# Altium schematic sheet ECAT0_(IN).SchDoc
size A3; SheetNumber: 3; SheetTotal: 7
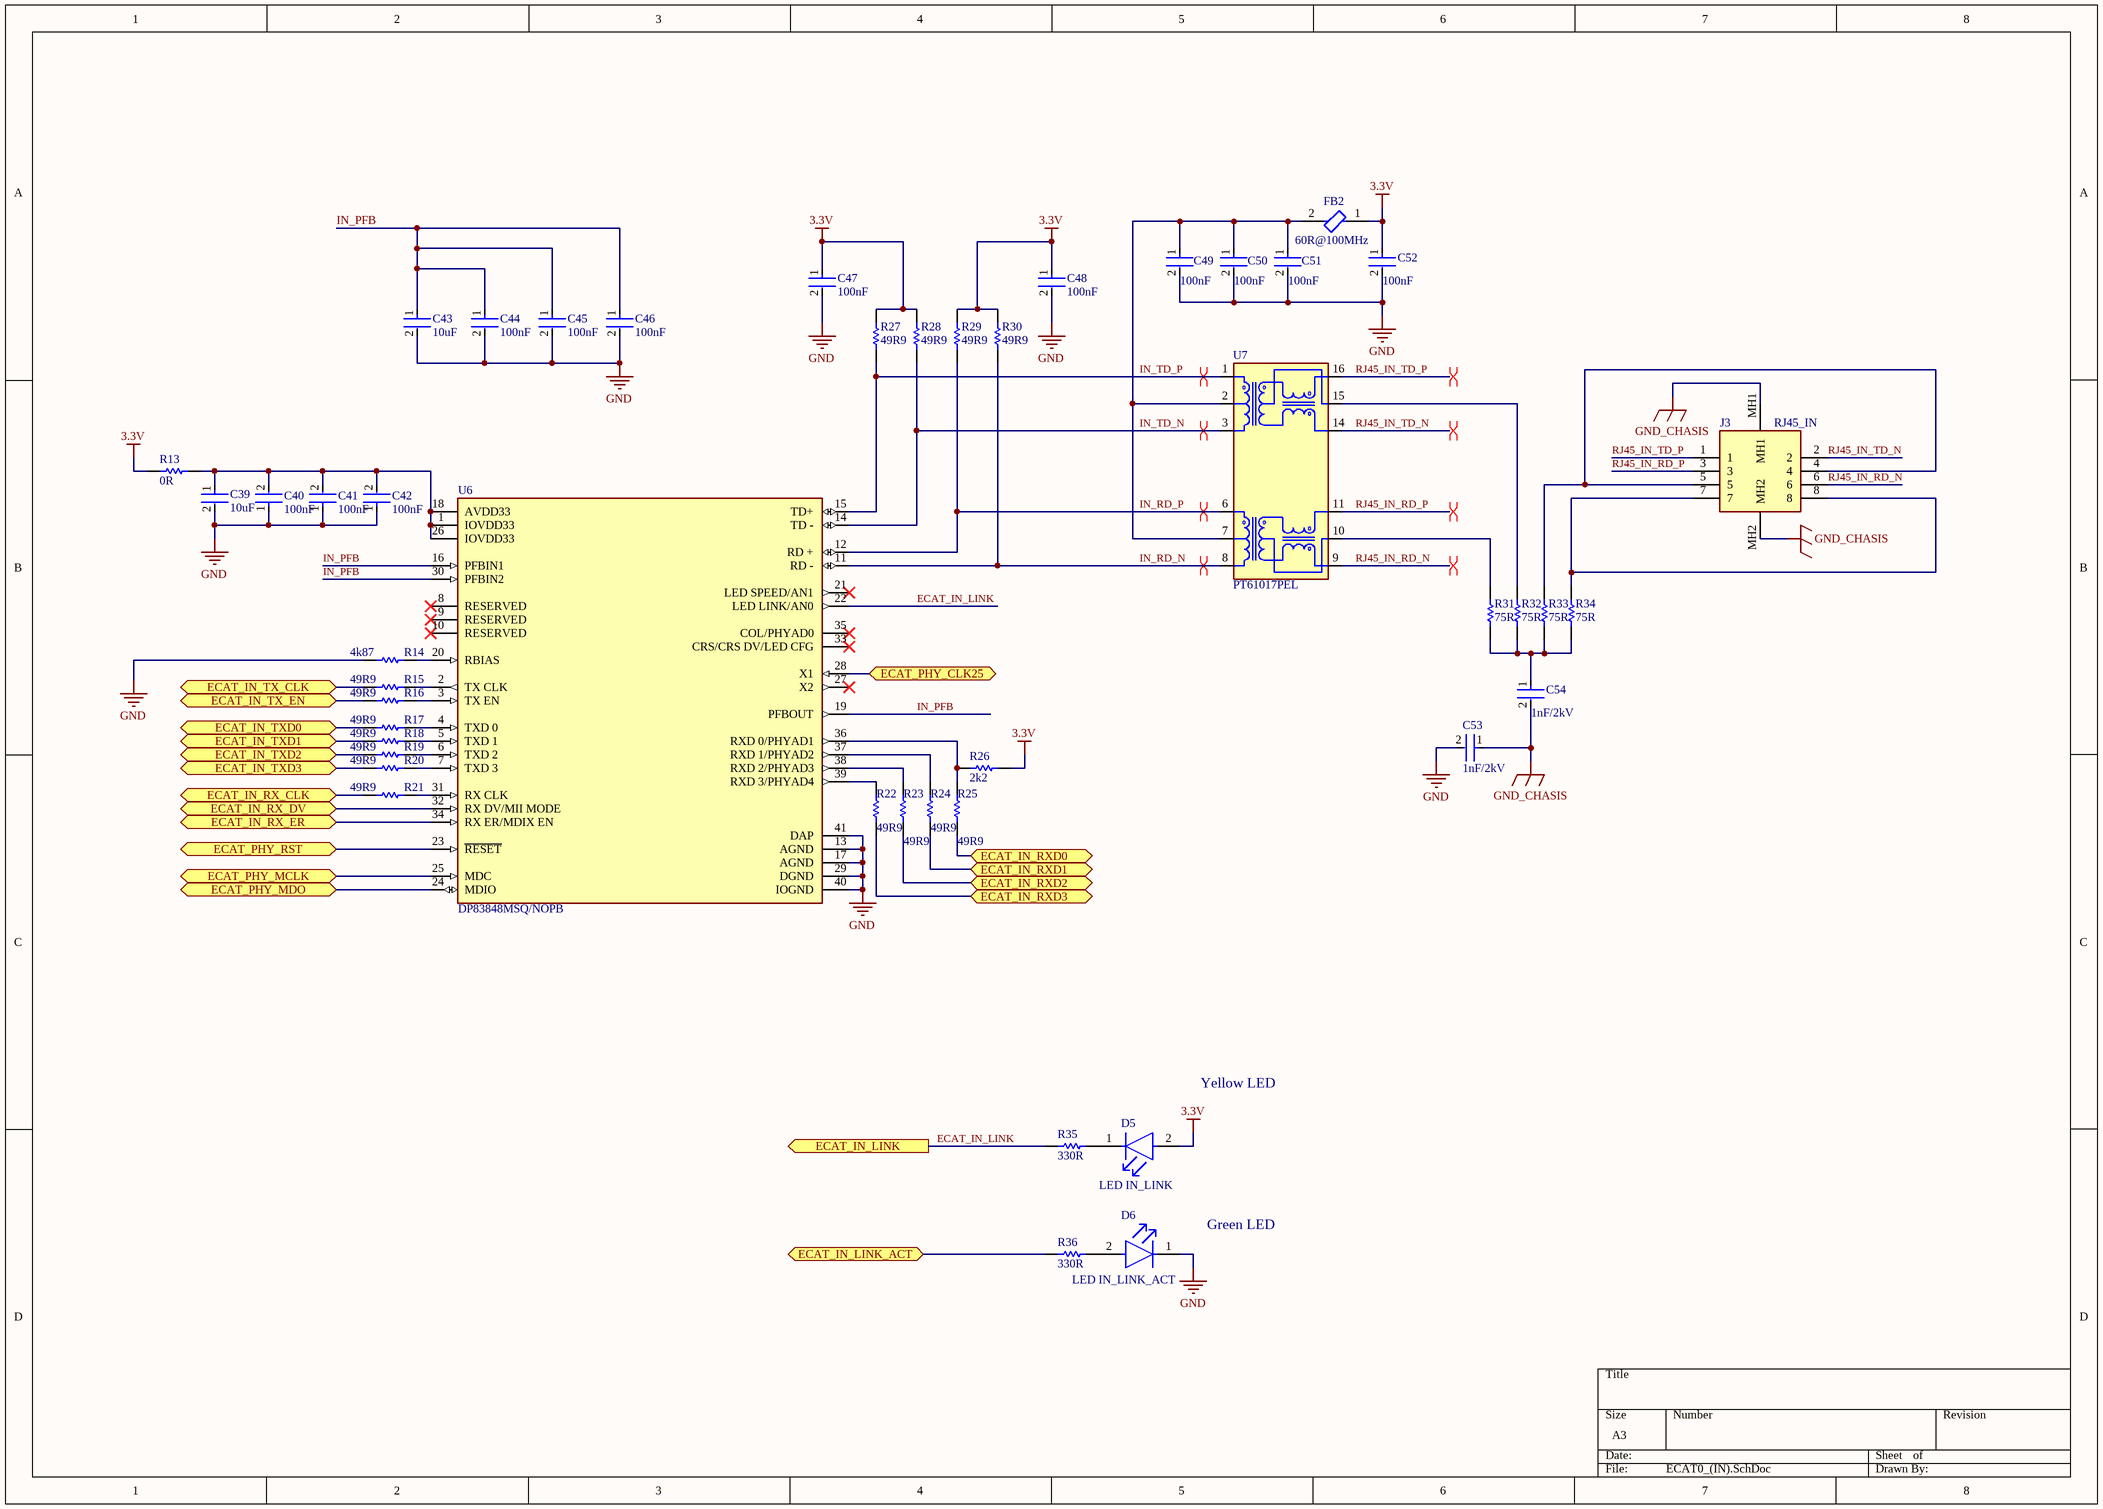
[diagram p0: ECAT0_(IN).SchDoc]

## Parts
C39  10uF  [FP-C0805C-DN-MFG]
C40  100nF  [FP-C0805C-DN-MFG]
C41  100nF  [FP-C0805C-DN-MFG]
C42  100nF  [FP-C0805C-DN-MFG]
C43  10uF  [FP-C0805C-DN-MFG]
C44  100nF  [FP-C0805C-DN-MFG]
C45  100nF  [FP-C0805C-DN-MFG]
C46  100nF  [FP-C0805C-DN-MFG]
C47  100nF  [FP-C0805C-DN-MFG]
C48  100nF  [FP-C0805C-DN-MFG]
C49  100nF  [FP-C0805C-DN-MFG]
C50  100nF  [FP-C0805C-DN-MFG]
C51  100nF  [FP-C0805C-DN-MFG]
C52  100nF  [FP-C0805C-DN-MFG]
C53  1nF/2kV  [FP-CC1206-0_3-1_45-IPC_C]
C54  1nF/2kV  [FP-CC1206-0_3-1_45-IPC_C]
D5  LED IN_LINK  [FP-LTST-C191GKT-MFG]
D6  LED IN_LINK_ACT  [FP-LTST-C191GKT-MFG]
FB2  60R@100MHz  [FP-BLM18-0_15-t0_8-IPC_B]
J3  RJ45_IN  [438600010]
R13  0R  [RESC1609X50X30NL8T20]
R14  4k87  [RESC2013X50X30LL20T20]
R15  49R9  [RESC2013X50X30LL20T20]
R16  49R9  [RESC2013X50X30LL20T20]
R17  49R9  [RESC2013X50X30LL20T20]
R18  49R9  [RESC2013X50X30LL20T20]
R19  49R9  [RESC2013X50X30LL20T20]
R20  49R9  [RESC2013X50X30LL20T20]
R21  49R9  [RESC2013X50X30LL20T20]
R22  49R9  [RESC2013X50X30LL20T20]
R23  49R9  [RESC2013X50X30LL20T20]
R24  49R9  [RESC2013X50X30LL20T20]
R25  49R9  [RESC2013X50X30LL20T20]
R26  2k2  [RESC2013X50X30LL20T20]
R27  49R9  [RESC2013X50X30LL20T20]
R28  49R9  [RESC2013X50X30LL20T20]
R29  49R9  [RESC2013X50X30LL20T20]
R30  49R9  [RESC2013X50X30LL20T20]
R31  75R  [RESC2013X50X30LL20T20]
R32  75R  [RESC2013X50X30LL20T20]
R33  75R  [RESC2013X50X30LL20T20]
R34  75R  [RESC2013X50X30LL20T20]
R35  330R  [RESC2013X50X30LL20T20]
R36  330R  [RESC2013X50X30LL20T20]
U6  DP83848MSQ/NOPB  [FP-RTA0040A-IPC_B]
U7  PT61017PEL  [PT61017PEL]

## Ports
ECAT_IN_LINK (out, see MCU[7B]), ECAT_IN_LINK_ACT (bidir, see MCU[7B]), ECAT_IN_RX_CLK (bidir, see MCU[7B]), ECAT_IN_RX_DV (bidir, see MCU[7C]), ECAT_IN_RX_ER (bidir, see MCU[5A]), ECAT_IN_RXD0 (bidir, see MCU[7A]), ECAT_IN_RXD1 (bidir, see MCU[7A]), ECAT_IN_RXD2 (bidir, see MCU[7A]), ECAT_IN_RXD3 (bidir, see MCU[7A]), ECAT_IN_TX_CLK (bidir, see MCU[7B]), ECAT_IN_TX_EN (bidir, see MCU[7B]), ECAT_IN_TXD0 (bidir, see MCU[7C]), ECAT_IN_TXD1 (bidir, see MCU[7C]), ECAT_IN_TXD2 (bidir, see MCU[7C]), ECAT_IN_TXD3 (bidir, see MCU[7B]), ECAT_PHY_CLK25 (bidir, see ECAT1_(OUT)[4B], MCU[6D]), ECAT_PHY_MCLK (bidir, see ECAT1_(OUT)[1C], MCU[5B]), ECAT_PHY_MDO (bidir, see ECAT1_(OUT)[1C], MCU[5B]), ECAT_PHY_RST (bidir, see ECAT1_(OUT)[1C], MCU[6C])

## Nets
3.3V: C47.1 C48.1 C52.1 D5.2(A) FB2.1 R13.2 R26.1 R27.2 R28.2 R29.2 R30.2
GND: C39.2 C40.1 C41.1 C42.1 C43.2 C44.2 C45.2 C46.2 C47.2 C48.2 C49.2 C50.2 C51.2 C52.2 C53.2 D6.1(C) R14.1 U6.13(AGND) U6.17(AGND) U6.29(DGND) U6.40(IOGND) U6.41(DAP)
GND_CHASIS: C53.1 C54.2 J3.MH1 J3.MH2
ECAT_IN_LINK: R35.1 U6.22(LED_LINK/AN0) ; port ECAT_IN_LINK
ECAT_IN_LINK_ACT: R36.1 ; port ECAT_IN_LINK_ACT
ECAT_IN_RX_CLK: R21.1 ; port ECAT_IN_RX_CLK
ECAT_IN_RX_DV: U6.32(RX_DV/MII_MODE) ; port ECAT_IN_RX_DV
ECAT_IN_RX_ER: U6.34(RX_ER/MDIX_EN) ; port ECAT_IN_RX_ER
ECAT_IN_RXD0: R25.1 ; port ECAT_IN_RXD0
ECAT_IN_RXD1: R24.1 ; port ECAT_IN_RXD1
ECAT_IN_RXD2: R23.1 ; port ECAT_IN_RXD2
ECAT_IN_RXD3: R22.1 ; port ECAT_IN_RXD3
ECAT_IN_TX_CLK: R15.1 ; port ECAT_IN_TX_CLK
ECAT_IN_TX_EN: R16.1 ; port ECAT_IN_TX_EN
ECAT_IN_TXD0: R17.1 ; port ECAT_IN_TXD0
ECAT_IN_TXD1: R18.1 ; port ECAT_IN_TXD1
ECAT_IN_TXD2: R19.1 ; port ECAT_IN_TXD2
ECAT_IN_TXD3: R20.1 ; port ECAT_IN_TXD3
ECAT_PHY_CLK25: U6.28(X1) ; port ECAT_PHY_CLK25
ECAT_PHY_MCLK: U6.25(MDC) ; port ECAT_PHY_MCLK
ECAT_PHY_MDO: U6.24(MDIO) ; port ECAT_PHY_MDO
ECAT_PHY_RST: U6.23(~{RESET}) ; port ECAT_PHY_RST
IN_PFB: C43.1 C44.1 C45.1 C46.1 U6.16(PFBIN1) U6.19(PFBOUT) U6.30(PFBIN2)
IN_RD_N: R30.1 U6.11(RD_-) U7.8
IN_RD_P: R29.1 U6.12(RD_+) U7.6
IN_TD_N: R28.1 U6.14(TD_-) U7.3
IN_TD_P: R27.1 U6.15(TD+) U7.1
RJ45_IN_RD_N: J3.6 U7.9
RJ45_IN_RD_P: J3.3 U7.11
RJ45_IN_TD_N: J3.2 U7.14
RJ45_IN_TD_P: J3.1 U7.16
NetC39_1: C39.1 C40.2 C41.2 C42.2 R13.1 U6.1(IOVDD33) U6.18(AVDD33) U6.26(IOVDD33)
NetC49_1: C49.1 C50.1 C51.1 FB2.2 U7.2 U7.7
NetC54_1: C54.1 R31.1 R32.1 R33.1 R34.1
NetD5_1: D5.1(C) R35.2
NetD6_2: D6.2(A) R36.2
NetJ3_4: J3.4 J3.5 R33.2
NetJ3_7: J3.7 J3.8 R34.2
NetR14_2: R14.2 U6.20(RBIAS)
NetR15_2: R15.2 U6.2(TX_CLK)
NetR16_2: R16.2 U6.3(TX_EN)
NetR17_2: R17.2 U6.4(TXD_0)
NetR18_2: R18.2 U6.5(TXD_1)
NetR19_2: R19.2 U6.6(TXD_2)
NetR20_2: R20.2 U6.7(TXD_3)
NetR21_2: R21.2 U6.31(RX_CLK)
NetR22_2: R22.2 U6.39(RXD_3/PHYAD4)
NetR23_2: R23.2 U6.38(RXD_2/PHYAD3)
NetR24_2: R24.2 U6.37(RXD_1/PHYAD2)
NetR25_2: R25.2 R26.2 U6.36(RXD_0/PHYAD1)
NetR31_2: R31.2 U7.10
NetR32_2: R32.2 U7.15

Not connected (* = marked no-connect by the designer): U6 8(RESERVED)* 9(RESERVED)* 10(RESERVED)* 21(LED_SPEED/AN1)* 27(X2)* 33(CRS/CRS_DV/LED_CFG)* 35(COL/PHYAD0)*

## Layout directives
differential pair; differential pair class IN_TD: IN_TD_N, IN_TD_P
differential pair; differential pair class IN_RD: IN_RD_N, IN_RD_P
differential pair; differential pair class RJ45_IN_TD: RJ45_IN_TD_N, RJ45_IN_TD_P
differential pair; differential pair class RJ45_IN_RD: RJ45_IN_RD_N, RJ45_IN_RD_P

## Notes on the sheet
- Yellow LED
- Green LED

## Library data of the parts
C39-C52 = CMP-2007-00279-2: CAP CER 0.1UF 50V X7R 0805; Manufacturer Part Number: C0805C104K5RACTU; Manufacturer: KEMET; Value: 0.10 μF; Tolerance: 0.1; Temperature Coefficient: 30ppm/°C; Material: Ceramic; Device Class L2: Capacitors; Temperature Range Low: -55°C; Voltage Rating: 50 V; Digikey Description: CAP CER 0.1UF 50V X7R 0805; Category: Cap; ComponentLink2Description: Datasheet; Octopart: https://octopart.com/c0805c104k5ractu-kemet-143926; RoHS: TRUE; ComponentLink2URL: https://content.kemet.com/datasheets/KEM_C1003_C0G_SMD.pdf; Temperature Characteristic: X7R; Temperature: -55°C to +125°C; Height: 0.88mm; Temperature Range High: +125°C; Device Class L1: Passive Components; Automotive: No; Lead Free: Yes; Ipc Land Pattern Name: CAPC200125X78; Device Class L3: Ceramic Capacitors; Mouser Description: Cap Ceramic 0.1uF 50V X7R 10% SMD 2.0 x 1.2 mm 125 C Paper T/R; Capacitance: 0.10 μF; Package: C0805C-DN
C53 C54 = CMP-2000-05436-2: 1nF/2kV/1206; Voltage Rating (DC): 2kV; Capacitance: 1nF; Dielectric: X7R; Insulation Resistance: 10GR; Dissipation Factor: 2.5%; Tolerance: 10%; Termination: SMD/SMT; Case/Package: 1206; Length: 3.2mm; Depth: 1.6mm; Case Code (Imperial): 1206; Package Quantity: 1; Packaging: Tape and Reel; Mount: Surface Mount; Max Operating Temperature: 125°C; Lead Free: Lead Free; Number of Pins: 2; Thickness: 0.057inch; Width: 0.063inch; Resistor Type: Ceramic; Series: CC; RoHS Compliant: Yes; Voltage Rating: 2kV; Radiation Hardening: No; Construction: Flat; Height: 1.25mm; Min Operating Temperature: -55°C; Voltage: 2kV; Case Code (Metric): 3216
D5 = CMP-22017-000029-1: KPHD-1608LVSYCK; Power Dissipation: 100mW; Lens Color: Colorless; Number of Elements: 1; Dominant Wavelength: 569nm; Illumination Color: Green; Lens Style: Clear; Forward Voltage: 2.1V; Forward Current: 30mA; Test Current: 20mA; Viewing Angle: 130°; Wavelength: 565nm; Luminous Intensity: 12mcd; Reverse Voltage: 5V; Case/Package: 0603; Package Quantity: 1; Lens Transparency: Clear; Depth: 0.8mm; Power Rating: 100mW; Width: 0.8mm; Height: 0.55mm; Radiation Hardening: No; Case Code (Imperial): 0603; Number of Pins: 2; Length: 1.6mm; Case Code (Metric): 1608; Max Operating Temperature: 85°C; Color: Green; Packaging: Tape and Reel; Mount: Surface Mount; Min Operating Temperature: -55°C; Lead Free: Lead Free; Number of LEDs: 1
D6 = CMP-22017-000029-1: KPHD-1608LVCGCK; Power Dissipation: 100mW; Lens Color: Colorless; Number of Elements: 1; Dominant Wavelength: 569nm; Illumination Color: Green; Lens Style: Clear; Forward Voltage: 2.1V; Forward Current: 30mA; Test Current: 20mA; Viewing Angle: 130°; Wavelength: 565nm; Luminous Intensity: 12mcd; Reverse Voltage: 5V; Case/Package: 0603; Package Quantity: 1; Lens Transparency: Clear; Depth: 0.8mm; Power Rating: 100mW; Width: 0.8mm; Height: 0.55mm; Radiation Hardening: No; Case Code (Imperial): 0603; Number of Pins: 2; Length: 1.6mm; Case Code (Metric): 1608; Max Operating Temperature: 85°C; Color: Green; Packaging: Tape and Reel; Mount: Surface Mount; Min Operating Temperature: -55°C; Lead Free: Lead Free; Number of LEDs: 1
FB2 = CMP-0686-00575-3: Chip Ferrite Bead, 0603, 60Ω @ 100MHz, 0.1Ω, , 1A; ESR (Equivalent Series Resistance): 60R; Number of Lines: 1; Material: Steel; Tolerance: 25%; Shielding: Unshielded; Current Rating: 500mA; Resistance: 100mR; Package Quantity: 1; Termination: SMD/SMT; Lead Free: Lead Free; Max Operating Temperature: 125°C; Number of Circuits: 1; Length: 1.6mm; Min Operating Temperature: -55°C; Case Code (Metric): 1608; Max DC Current: 500mA; REACH SVHC: No SVHC; Frequency: 100MHz; Number of Pins: 2; RoHS Compliant: Yes; Height: 0.8mm; Depth: 0.8mm; Width: 0.8mm; Test Frequency: 100MHz; Case/Package: 0603; Impedance: 60R; Max Current Rating: 500mA; Packaging: Tape and Reel; DC Resistance (DCR): 100mR; Case Code (Imperial): 0603; Core Material: Ferrite
J3 = 43860-0010: Modular Jack Right Angle 8/8 RJ45 Invert Molex Cat3 RJ45 Modular Jack Socket, Right Angle, Through Hole 43860 / 43860-0010; Geometry.Height: 13.79mm; Mouser Part Number: 538-43860-0010; Mouser Price/Stock: https://www.mouser.co.uk/ProductDetail/Molex/43860-0010?qs=qjii0NTOo%252B4EzowI%2FkFJuQ%3D%3D; Manufacturer_Name: Molex; Manufacturer_Part_Number: 43860-0010; Datasheet Link: https://www.molex.com/webdocs/datasheets/pdf/en-us/0438600010_MODULAR_JACKS_PLUG.pdf
R13 = CMP-2000-03816-5: 0603; Manufacturer: Vishay Semiconductor; Voltage Rating: 75 V; Package Quantity: 5000; DatasheetVersion: 06/2012; Min Operating Temperature: -55 degC; ComponentLink1URL: http://www.vishay.com/; Mounting Technology: Surface Mount; Height: 0.45 mm; ComponentLink1Description: Manufacturer URL; REACH SVHC: Unknown; PackageReference: 0603; Packaging: Tape and Reel; Max Operating Temperature: 155 degC; Mount: Surface Mount; ComponentLink2Description: Datasheet; PackageDescription: 2-Pin Surface Mount Device, Body 1.575 x 0.85 mm; Length: 1.55 mm; ComponentLink2URL: http://www.vishay.com/docs/20035/dcrcwe3.pdf; Pins: 2; RoHSCompliant: true
R14-R36 = CMP-2001-04896-1: 0805; Manufacturer: Vishay Dale; Part Number: CRCW08050000Z0EA
U6 = CMP-0058-00351-5: IC TRANSCEIVER 1/1 40WQFN; Number of Ports: 1; Cable Length: 137m; Data Rate: 100Mbps; Interface: Serial; Max Power Dissipation: 264mW; Nominal Supply Current: 92mA; Operating Supply Voltage: 3.3V; Max Supply Voltage: 3.6V; Min Supply Voltage: 3V; Series: DP83848M; Packaging: Tape and Reel; Number of Transceivers: 1; Max Operating Temperature: 70°C; Number of Channels: 1; Lead Free: Lead Free; Height: 0.8mm; Termination: SMD/SMT; Min Operating Temperature: 0°C; Mount: Surface Mount; Width: 4.6mm; Package Quantity: 250; Radiation Hardening: No; RoHS Compliant: Yes; REACH SVHC: No SVHC; Length: 4.6mm; Number of Pins: 40; Supply Current: 92mA
U7 = PT61017PEL: 350 µH LAN 10/100 Base-T Pulse Transformer 1CT:1CT Surface Mount / PT61017PEL; MF: Bourns; Package: SMD-16 Bourns; Price: None; Availability: In Stock; Purchase-URL: https://pricing.snapeda.com/search/part/PT61017PEL/?ref=eda; Check_prices: https://www.snapeda.com/parts/PT61017PEL/Bourns/view-part/?ref=eda; MP: PT61017PEL; SnapEDA_Link: https://www.snapeda.com/parts/PT61017PEL/Bourns/view-part/?ref=snap; Value: *